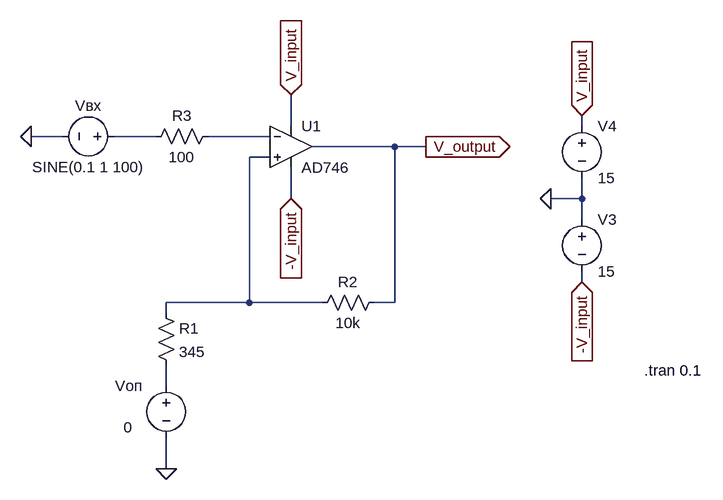
[diagram p0: schematic Гистерезис.asc]
Гистерезис.asc, the LTspice schematic file:
Version 4
SHEET 1 1092 680
WIRE 432 112 432 64
WIRE 880 112 880 96
WIRE 80 128 32 128
WIRE 224 128 160 128
WIRE 400 128 304 128
WIRE 592 144 464 144
WIRE 640 144 592 144
WIRE 400 160 368 160
WIRE 432 224 432 176
WIRE 880 224 880 192
WIRE 880 224 832 224
WIRE 880 256 880 224
WIRE 880 352 880 336
WIRE 368 384 368 160
WIRE 368 384 240 384
WIRE 480 384 368 384
WIRE 592 384 592 144
WIRE 592 384 560 384
WIRE 240 400 240 384
WIRE 240 512 240 480
WIRE 240 640 240 592
FLAG 32 128 0
FLAG 240 640 0
FLAG 432 64 V_input
IOPIN 432 64 In
FLAG 432 224 -V_input
IOPIN 432 224 In
FLAG 640 144 V_output
IOPIN 640 144 Out
FLAG 832 224 0
FLAG 880 96 V_input
IOPIN 880 96 In
FLAG 880 352 -V_input
IOPIN 880 352 In
SYMBOL res 320 112 R90
WINDOW 0 0 56 VBottom 2
WINDOW 3 32 56 VTop 2
SYMATTR InstName R3
SYMATTR Value 100
SYMBOL voltage 176 128 R90
WINDOW 0 -32 56 VBottom 2
WINDOW 3 32 56 VTop 2
WINDOW 123 0 0 Left 0
WINDOW 39 0 0 Left 0
SYMATTR InstName Vвх
SYMATTR Value SINE(0.1 1 100)
SYMBOL res 224 384 R0
SYMATTR InstName R1
SYMATTR Value 345
SYMBOL Opamps\\AD746 432 80 R0
SYMATTR InstName U1
SYMBOL voltage 880 240 R0
WINDOW 123 0 0 Left 0
WINDOW 39 0 0 Left 0
SYMATTR InstName V3
SYMATTR Value 15
SYMBOL voltage 880 96 R0
WINDOW 123 0 0 Left 0
WINDOW 39 0 0 Left 0
SYMATTR InstName V4
SYMATTR Value 15
SYMBOL voltage 240 496 R0
WINDOW 0 -79 16 Left 2
WINDOW 3 -66 80 Left 2
WINDOW 123 0 0 Left 0
WINDOW 39 0 0 Left 0
SYMATTR InstName Vоп
SYMATTR Value 0
SYMBOL res 576 368 R90
WINDOW 0 0 56 VBottom 2
WINDOW 3 32 56 VTop 2
SYMATTR InstName R2
SYMATTR Value 10k
TEXT 976 488 Left 2 !.tran 0.1

The netlist it stands for:
* Гистерезис.asc
R3 N002 N001 100
Vвх N001 0 SINE(0.1 1 100)
R1 N003 N004 345
XU1 N003 N002 V_input -V_input V_output AD746  ; pins In+ In- V+ V- OUT
V3 0 -V_input 15
V4 V_input 0 15
Vоп N004 0 0
R2 V_output N003 10k
.tran 0.1
.backanno
.end